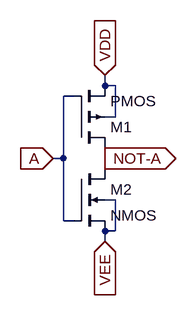
[diagram p0: schematic Inverter_Gate_Symbol.asc]
Inverter_Gate_Symbol.asc, the LTspice schematic file:
Version 4
SHEET 1 880 680
WIRE 448 224 448 208
WIRE 464 224 448 224
WIRE 400 240 384 240
WIRE 464 272 464 224
WIRE 464 272 448 272
WIRE 384 336 384 240
WIRE 384 336 368 336
WIRE 448 336 448 320
WIRE 448 352 448 336
WIRE 464 400 448 400
WIRE 384 432 384 336
WIRE 400 432 384 432
WIRE 464 448 464 400
WIRE 464 448 448 448
WIRE 448 464 448 448
FLAG 448 336 NOT-A
IOPIN 448 336 Out
FLAG 448 208 VDD
IOPIN 448 208 In
FLAG 448 464 VEE
IOPIN 448 464 In
FLAG 368 336 A
IOPIN 368 336 In
SYMBOL pmos4 400 320 M180
SYMATTR InstName M1
SYMBOL nmos4 400 352 R0
SYMATTR InstName M2

The netlist it stands for:
* Inverter_Gate_Symbol.asc
M1 NOT-A A VDD VDD PMOS
M2 NOT-A A VEE VEE NMOS
.model NMOS NMOS
.model PMOS PMOS
.lib standard.mos
.backanno
.end